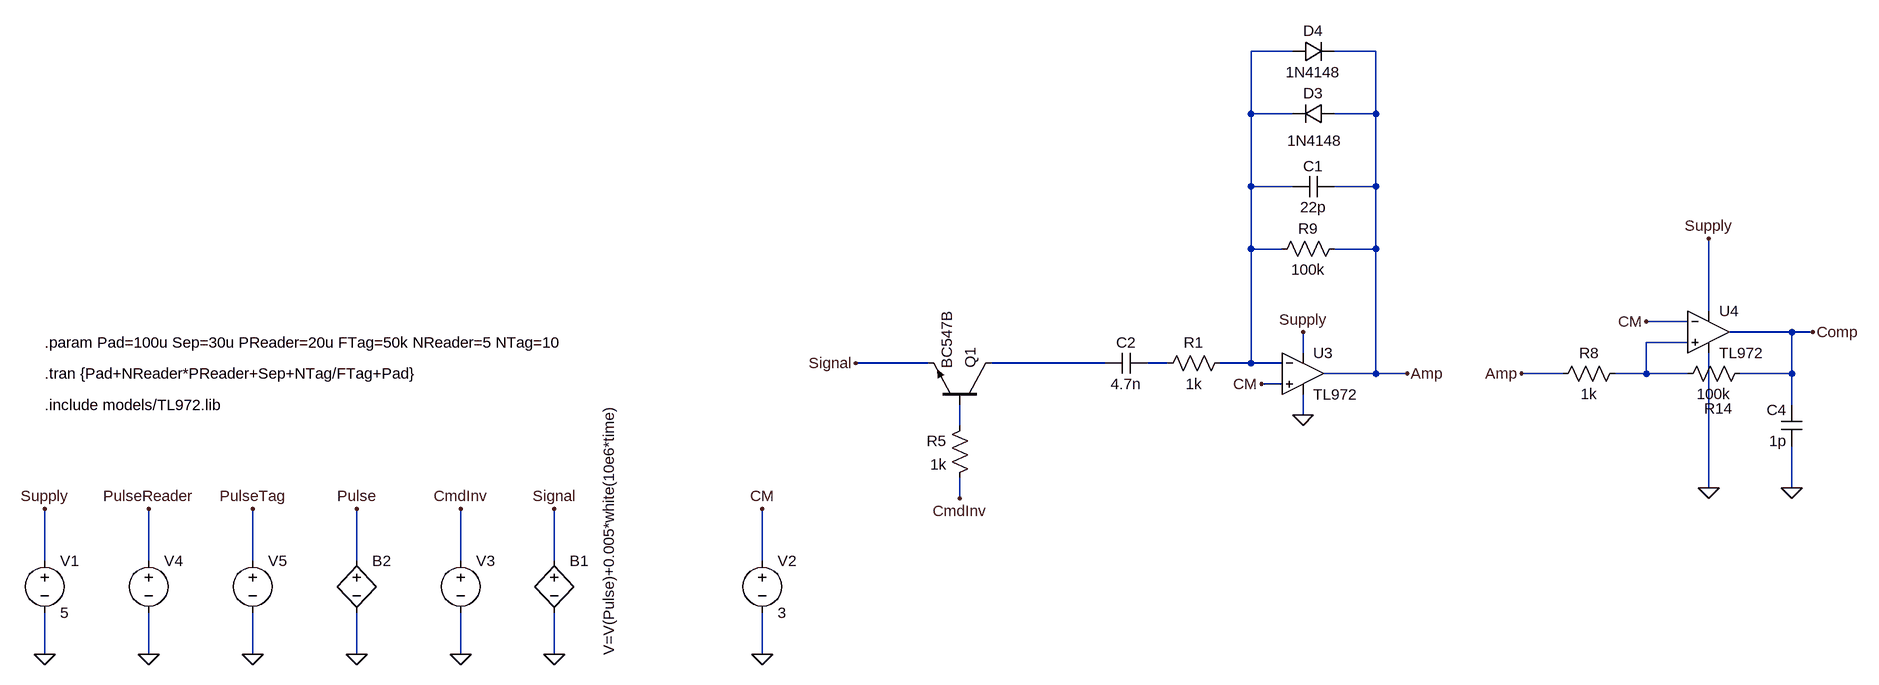
[diagram p0: schematic demod_dual_opv.asc]
demod_dual_opv.asc, the LTspice schematic file:
Version 4
SHEET 1 3092 880
WIRE -480 -768 -544 -768
WIRE -352 -768 -416 -768
WIRE -544 -672 -544 -768
WIRE -480 -672 -544 -672
WIRE -352 -672 -352 -768
WIRE -352 -672 -416 -672
WIRE -544 -560 -544 -672
WIRE -480 -560 -544 -560
WIRE -352 -560 -352 -672
WIRE -352 -560 -416 -560
WIRE -544 -464 -544 -560
WIRE -496 -464 -544 -464
WIRE -352 -464 -352 -560
WIRE -352 -464 -416 -464
WIRE 160 -368 160 -480
WIRE 128 -352 64 -352
WIRE 288 -336 192 -336
WIRE 320 -336 288 -336
WIRE 128 -320 64 -320
WIRE -464 -304 -464 -336
WIRE -1040 -288 -1152 -288
WIRE -768 -288 -944 -288
WIRE -672 -288 -704 -288
WIRE -544 -288 -544 -464
WIRE -544 -288 -592 -288
WIRE -496 -288 -544 -288
WIRE -352 -272 -352 -464
WIRE -352 -272 -432 -272
WIRE -304 -272 -352 -272
WIRE -64 -272 -128 -272
WIRE 64 -272 64 -320
WIRE 64 -272 16 -272
WIRE 128 -272 64 -272
WIRE 288 -272 288 -336
WIRE 288 -272 208 -272
WIRE -496 -256 -528 -256
WIRE 288 -224 288 -272
WIRE -464 -208 -464 -240
WIRE -992 -192 -992 -224
WIRE 160 -96 160 -304
WIRE 288 -96 288 -160
WIRE -992 -80 -992 -112
WIRE -2400 16 -2400 -64
WIRE -2240 16 -2240 -64
WIRE -2080 16 -2080 -64
WIRE -1920 16 -1920 -64
WIRE -1760 16 -1760 -64
WIRE -1616 16 -1616 -64
WIRE -1296 16 -1296 -64
WIRE -2400 160 -2400 96
WIRE -2240 160 -2240 96
WIRE -2080 160 -2080 96
WIRE -1920 160 -1920 96
WIRE -1760 160 -1760 96
WIRE -1616 160 -1616 96
WIRE -1296 160 -1296 96
FLAG -2400 160 0
FLAG -2400 -64 Supply
FLAG -1760 160 0
FLAG -1760 -64 CmdInv
FLAG -304 -272 Amp
FLAG -1616 -64 Signal
FLAG -1616 160 0
FLAG -2240 160 0
FLAG -2240 -64 PulseReader
FLAG -2080 160 0
FLAG -2080 -64 PulseTag
FLAG -1920 160 0
FLAG -1920 -64 Pulse
FLAG -464 -208 0
FLAG -464 -336 Supply
FLAG -528 -256 CM
FLAG -1152 -288 Signal
FLAG 160 -96 0
FLAG 160 -480 Supply
FLAG 320 -336 Comp
FLAG -128 -272 Amp
FLAG 64 -352 CM
FLAG -992 -80 CmdInv
FLAG 288 -96 0
FLAG -1296 160 0
FLAG -1296 -64 CM
SYMBOL voltage -2400 0 R0
WINDOW 123 0 0 Left 0
WINDOW 39 0 0 Left 0
SYMATTR InstName V1
SYMATTR Value 5
SYMBOL voltage -1760 0 R0
WINDOW 3 24 96 Invisible 2
WINDOW 123 0 0 Left 0
WINDOW 39 70 -90 VRight 2
SYMATTR Value PULSE(5 0 {Pad-150n} 100n 100n {NReader*PReader-PReader/2+100n})
SYMATTR InstName V3
SYMBOL bv -1616 0 R0
WINDOW 3 84 -226 VRight 2
SYMATTR Value V=V(Pulse)+0.005*white(10e6*time)
SYMATTR InstName B1
SYMBOL voltage -2240 0 R0
WINDOW 3 89 -171 Invisible 2
WINDOW 123 0 0 Left 0
WINDOW 39 0 0 Left 0
SYMATTR Value PULSE(1 5m {Pad} 10n 10n {PReader/2} {PReader} {NReader})
SYMATTR InstName V4
SYMBOL voltage -2080 0 R0
WINDOW 3 89 -171 Invisible 2
WINDOW 123 0 0 Left 0
WINDOW 39 0 0 Left 0
SYMATTR Value PULSE(0 5m {Pad+NReader*PReader-PReader/2+Sep} 10n 10n {(1/FTag)/2} {1/FTag} {NTag})
SYMATTR InstName V5
SYMBOL bv -1920 0 R0
WINDOW 3 81 -166 Invisible 2
SYMATTR Value V=V(PulseReader)+V(PulseTag)
SYMATTR InstName B2
SYMBOL res -576 -304 R90
WINDOW 0 0 56 VBottom 2
WINDOW 3 32 56 VTop 2
SYMATTR InstName R1
SYMATTR Value 1k
SYMBOL cap -704 -304 R90
WINDOW 0 0 32 VBottom 2
WINDOW 3 32 32 VTop 2
SYMATTR InstName C2
SYMATTR Value 4.7n
SYMBOL res -400 -480 R90
WINDOW 0 0 56 VBottom 2
WINDOW 3 32 56 VTop 2
SYMATTR InstName R9
SYMATTR Value 100k
SYMBOL res 32 -288 R90
WINDOW 0 0 56 VBottom 2
WINDOW 3 32 56 VTop 2
SYMATTR InstName R8
SYMATTR Value 1k
SYMBOL res 224 -288 R90
WINDOW 0 85 49 VBottom 2
WINDOW 3 32 56 VTop 2
SYMATTR InstName R14
SYMATTR Value 100k
SYMBOL Opamps/opamp2 -464 -336 R0
SYMATTR InstName U3
SYMATTR Value TL972
SYMBOL Opamps/opamp2 160 -400 R0
SYMATTR InstName U4
SYMATTR Value TL972
SYMBOL cap -416 -576 R90
WINDOW 0 0 32 VBottom 2
WINDOW 3 32 32 VTop 2
SYMATTR InstName C1
SYMATTR Value 22p
SYMBOL res -976 -208 M0
SYMATTR InstName R5
SYMATTR Value 1k
SYMBOL npn -944 -224 M270
SYMATTR InstName Q1
SYMATTR Value BC547B
SYMBOL cap 304 -160 R180
WINDOW 0 24 56 Left 2
WINDOW 3 24 8 Left 2
SYMATTR InstName C4
SYMATTR Value 1p
SYMBOL voltage -1296 0 R0
WINDOW 123 0 0 Left 0
WINDOW 39 0 0 Left 0
SYMATTR InstName V2
SYMATTR Value 3
SYMBOL diode -416 -688 R90
WINDOW 0 0 32 VBottom 2
WINDOW 3 42 30 VTop 2
SYMATTR InstName D3
SYMATTR Value 1N4148
SYMATTR Description Light Emitting Diode
SYMATTR Type led
SYMBOL diode -480 -752 R270
WINDOW 0 32 32 VTop 2
WINDOW 3 0 32 VBottom 2
SYMATTR InstName D4
SYMATTR Value 1N4148
SYMATTR Description Light Emitting Diode
SYMATTR Type led
TEXT -2400 -272 Left 2 !.tran {Pad+NReader*PReader+Sep+NTag/FTag+Pad}
TEXT -2400 -320 Left 2 !.param Pad=100u Sep=30u PReader=20u FTag=50k NReader=5 NTag=10
TEXT -2400 -224 Left 2 !.include models/TL972.lib

The netlist it stands for:
* demod_dual_opv.asc
V1 Supply 0 5
V3 CmdInv 0 PULSE(5 0 {Pad-150n} 100n 100n {NReader*PReader-PReader/2+100n})
B1 Signal 0 V=V(Pulse)+0.005*white(10e6*time)
V4 PulseReader 0 PULSE(1 5m {Pad} 10n 10n {PReader/2} {PReader} {NReader})
V5 PulseTag 0 PULSE(0 5m {Pad+NReader*PReader-PReader/2+Sep} 10n 10n {(1/FTag)/2} {1/FTag} {NTag})
B2 Pulse 0 V=V(PulseReader)+V(PulseTag)
R1 N001 N004 1k
C2 N004 N003 4.7n
R9 Amp N001 100k
R8 N002 Amp 1k
R14 Comp N002 100k
XU3 CM N001 Supply 0 Amp TL972  ; pins In+ In- V+ V- OUT
XU4 N002 CM Supply 0 Comp TL972  ; pins In+ In- V+ V- OUT
C1 Amp N001 22p
R5 N005 CmdInv 1k
Q1 N003 N005 Signal 0 BC547B
C4 0 Comp 1p
V2 CM 0 3
D3 Amp N001 1N4148
D4 N001 Amp 1N4148
.model D D
.lib standard.dio
.model NPN NPN
.model PNP PNP
.lib standard.bjt
.tran {Pad+NReader*PReader+Sep+NTag/FTag+Pad}
.param Pad=100u Sep=30u PReader=20u FTag=50k NReader=5 NTag=10
.include models/TL972.lib
.backanno
.end